# Altium schematic sheet Edge_Card_Interface.SchDoc
size A2; DocumentNumber: 9; SheetNumber: 9; SheetTotal: 10
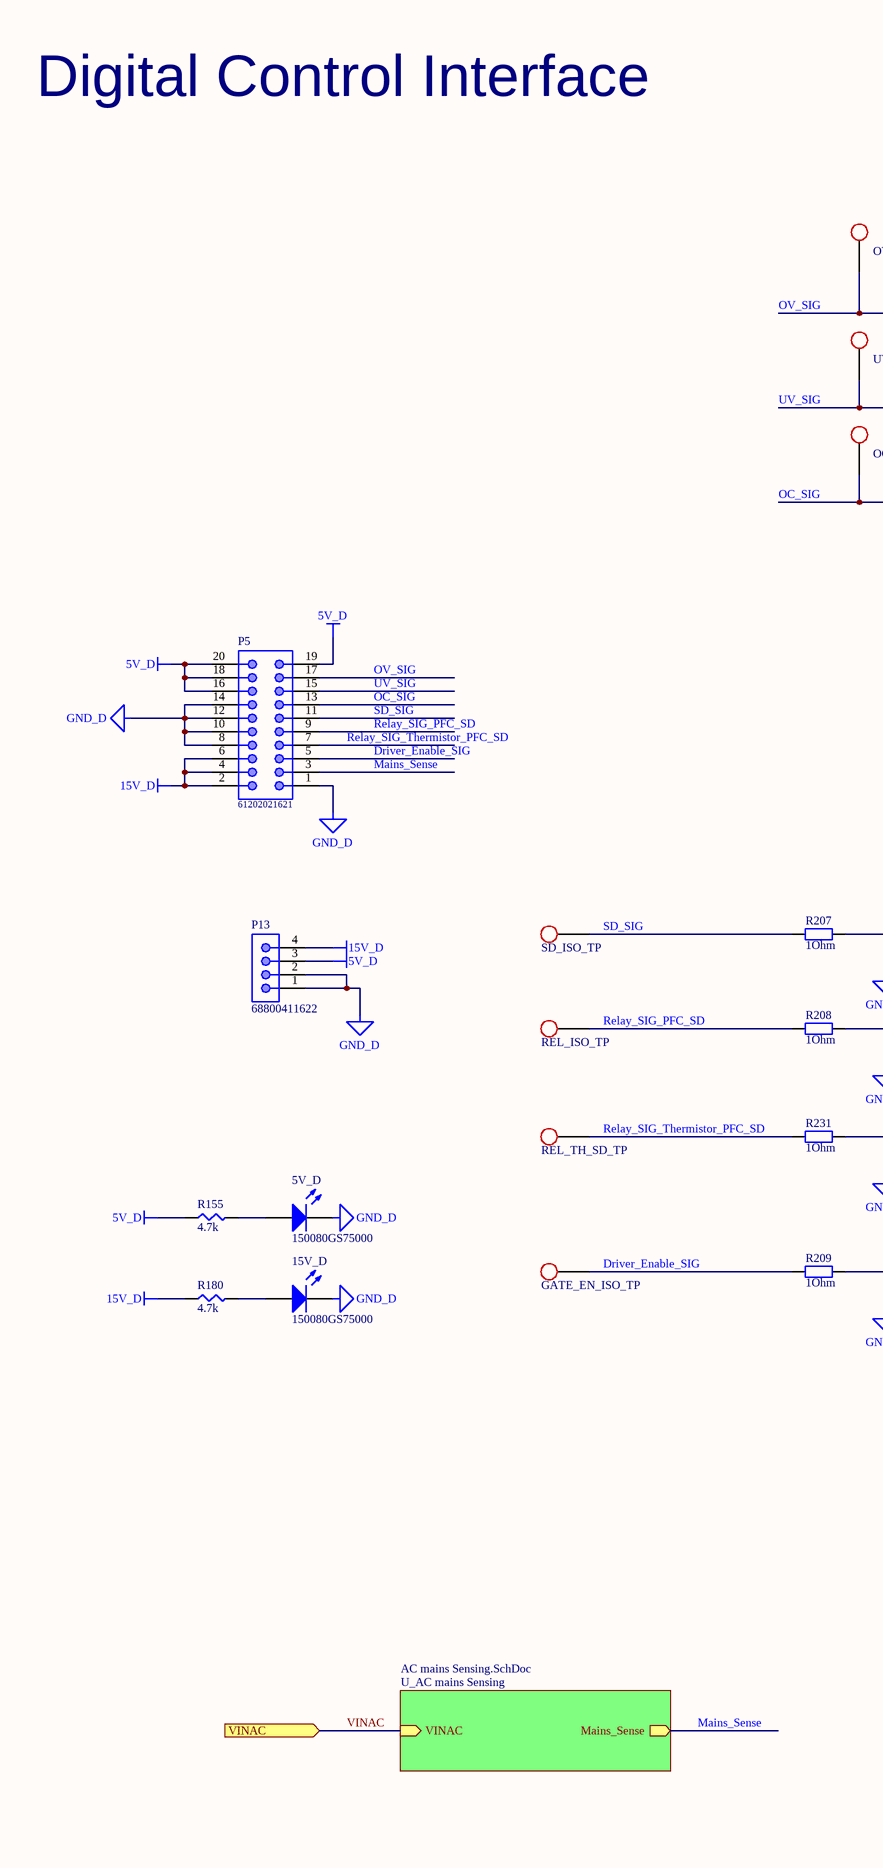
[diagram p0: Edge_Card_Interface.SchDoc, left]
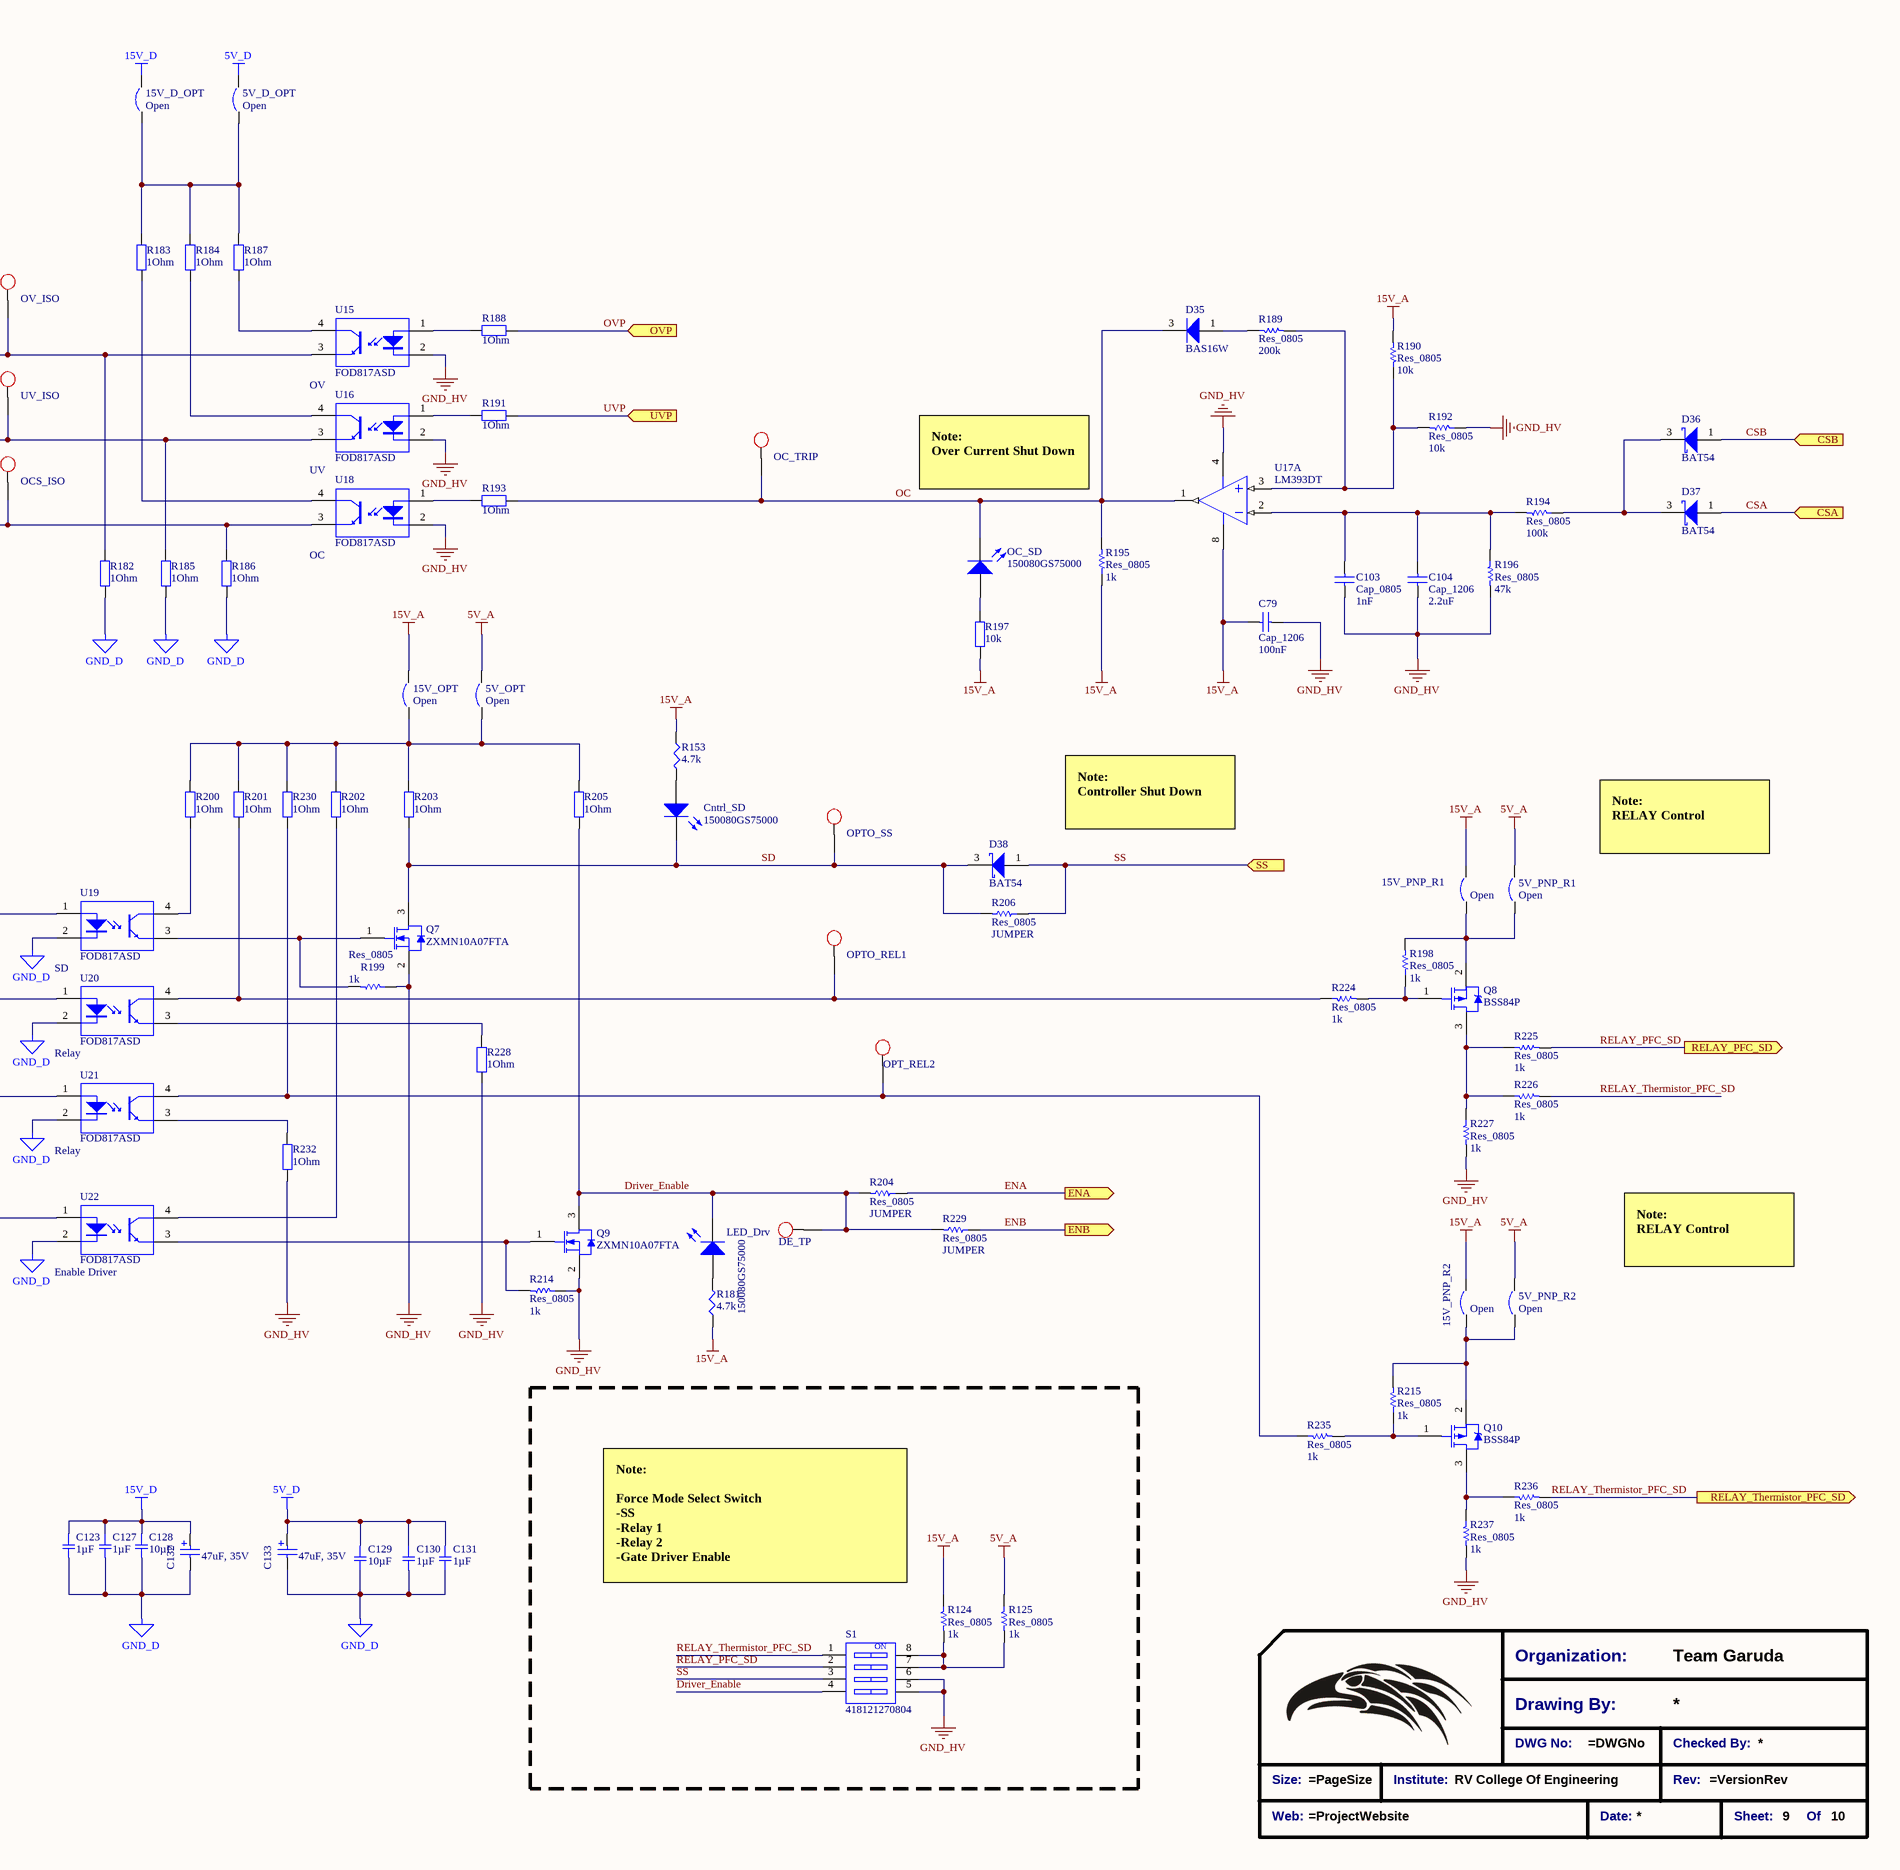
[diagram p1: Edge_Card_Interface.SchDoc, right]

## Parts
5V_D  150080GS75000  [0805_A]
5V_D_OPT  Open  [Solder Bridge - HP]  (no BOM)
5V_OPT  Open  [Solder Bridge - HP]  (no BOM)
5V_PNP_R1  Open  [Solder Bridge - HP - SQ]  (no BOM)
5V_PNP_R2  Open  [Solder Bridge - HP - SQ]  (no BOM)
15V_D  150080GS75000  [0805_A]
15V_D_OPT  Open  [Solder Bridge - HP]  (no BOM)
15V_OPT  Open  [Solder Bridge - HP]  (no BOM)
15V_PNP_R1  Open  [Solder Bridge - HP - SQ]  (no BOM)
15V_PNP_R2  Open  [Solder Bridge - HP - SQ]  (no BOM)
*?  Title_Block  (value not drawn)  (graphical)
C79  Cap_1206  value 100nF  [SMD-1206C]
C103  Cap_0805  Size: 1nF  [SMD-0805C]
C104  Cap_1206  value 2.2uF  [SMD-1206C]
C123  1µF  [SMD-0805C]
C127  1µF  [SMD-0805C]
C128  10µF  [SMD-1206C]
C129  10µF  [SMD-1206C]
C130  1µF  [SMD-0805C]
C131  1µF  [SMD-0805C]
C132  47uF, 35V  [WCAP-ASLU_6.3x7.7]
C133  47uF, 35V  [WCAP-ASLU_6.3x7.7]
Cntrl_SD  150080GS75000  [0805_A]
D35  BAS16W  [SOT95P278X110-3N]
D36  BAT54  [SOT95P278X110-3N]
D37  BAT54  [SOT95P278X110-3N]
D38  BAT54  [SOT95P278X110-3N]
DE_TP  Test Point  [Test_point_SMD]  (value not drawn)  (no BOM)
GATE_EN_ISO_TP  Test Point  [Test_point_SMD]  (value not drawn)  (no BOM)
LED_Drv  150080GS75000  [0805_A]
OC_SD  150080GS75000  [0805_A]
OC_TRIP  Test Point  [Test_point_SMD]  (value not drawn)  (no BOM)
OCS_ISO  Test Point  [Test_point_SMD]  (value not drawn)  (no BOM)
OPT_REL2  Test Point  [Test_point_SMD]  (value not drawn)  (no BOM)
OPTO_REL1  Test Point  [Test_point_SMD]  (value not drawn)  (no BOM)
OPTO_SS  Test Point  [Test_point_SMD]  (value not drawn)  (no BOM)
OV_ISO  Test Point  [Test_point_SMD]  (value not drawn)  (no BOM)
P5  61202021621  [61202021621]
P13  68800411622  [68800411622]
Q7  ZXMN10A07FTA  [DIOD-SOT23-3_D_V]
Q8  BSS84P  [SOT95P278X110-3N]
Q9  ZXMN10A07FTA  [DIOD-SOT23-3_D_V]
Q10  BSS84P  [SOT95P278X110-3N]
R124  Res_0805  value 1k  [WRIS-KSKE_0805_H=0.6mm]
R125  Res_0805  value 1k  [WRIS-KSKE_0805_H=0.6mm]
R153  4.7k  [SMD-0805-RES]
R155  4.7k  [SMD-0805-RES]
R180  4.7k  [SMD-0805-RES]
R181  4.7k  [SMD-0805-RES]
R182  1Ohm  [WRIS-KSKE_0805_H=0.6mm]
R183  1Ohm  [WRIS-KSKE_0805_H=0.6mm]
R184  1Ohm  [WRIS-KSKE_0805_H=0.6mm]
R185  1Ohm  [WRIS-KSKE_0805_H=0.6mm]
R186  1Ohm  [WRIS-KSKE_0805_H=0.6mm]
R187  1Ohm  [WRIS-KSKE_0805_H=0.6mm]
R188  1Ohm  [WRIS-KSKE_0805_H=0.6mm]
R189  Res_0805  value 200k  [WRIS-KSKE_0805_H=0.6mm]
R190  Res_0805  value 10k  [WRIS-KSKE_0805_H=0.6mm]
R191  1Ohm  [WRIS-KSKE_0805_H=0.6mm]
R192  Res_0805  value 10k  [WRIS-KSKE_0805_H=0.6mm]
R193  1Ohm  [WRIS-KSKE_0805_H=0.6mm]
R194  Res_0805  value 100k  [WRIS-KSKE_0805_H=0.6mm]
R195  Res_0805  value 1k  [WRIS-KSKE_0805_H=0.6mm]
R196  Res_0805  value 47k  [WRIS-KSKE_0805_H=0.6mm]
R197  10k  [WRIS-KSKE_0805_H=0.6mm]
R198  Res_0805  value 1k  [WRIS-KSKE_0805_H=0.6mm]
R199  Res_0805  value 1k  [WRIS-KSKE_0805_H=0.6mm]
R200  1Ohm  [WRIS-KSKE_0805_H=0.6mm]
R201  1Ohm  [WRIS-KSKE_0805_H=0.6mm]
R202  1Ohm  [WRIS-KSKE_0805_H=0.6mm]
R203  1Ohm  [WRIS-KSKE_0805_H=0.6mm]
R204  Res_0805  value JUMPER  [WRIS-KSKE_0805_H=0.6mm]
R205  1Ohm  [WRIS-KSKE_0805_H=0.6mm]
R206  Res_0805  value JUMPER  [WRIS-KSKE_0805_H=0.6mm]
R207  1Ohm  [WRIS-KSKE_0805_H=0.6mm]
R208  1Ohm  [WRIS-KSKE_0805_H=0.6mm]
R209  1Ohm  [WRIS-KSKE_0805_H=0.6mm]
R214  Res_0805  value 1k  [WRIS-KSKE_0805_H=0.6mm]
R215  Res_0805  value 1k  [WRIS-KSKE_0805_H=0.6mm]
R224  Res_0805  value 1k  [WRIS-KSKE_0805_H=0.6mm]
R225  Res_0805  value 1k  [WRIS-KSKE_0805_H=0.6mm]
R226  Res_0805  value 1k  [WRIS-KSKE_0805_H=0.6mm]
R227  Res_0805  value 1k  [WRIS-KSKE_0805_H=0.6mm]
R228  1Ohm  [WRIS-KSKE_0805_H=0.6mm]
R229  Res_0805  value JUMPER  [WRIS-KSKE_0805_H=0.6mm]
R230  1Ohm  [WRIS-KSKE_0805_H=0.6mm]
R231  1Ohm  [WRIS-KSKE_0805_H=0.6mm]
R232  1Ohm  [WRIS-KSKE_0805_H=0.6mm]
R235  Res_0805  value 1k  [WRIS-KSKE_0805_H=0.6mm]
R236  Res_0805  value 1k  [WRIS-KSKE_0805_H=0.6mm]
R237  Res_0805  value 1k  [WRIS-KSKE_0805_H=0.6mm]
REL_ISO_TP  Test Point  [Test_point_SMD]  (value not drawn)  (no BOM)
REL_TH_SD_TP  Test Point  [Test_point_SMD]  (value not drawn)  (no BOM)
S1  418121270804  [418121270804]
SD_ISO_TP  Test Point  [Test_point_SMD]  (value not drawn)  (no BOM)
U15  FOD817ASD  Signal: OV  [FAIR-MDIP-4_V]
U16  FOD817ASD  Signal: UV  [FAIR-MDIP-4_V]
U17  LM393DT  [SOIC127P570X175_HS-9N - No Thermal]  (part A of 2)
U18  FOD817ASD  Signal: OC  [FAIR-MDIP-4_V]
U19  FOD817ASD  Signal: SD  [FAIR-MDIP-4_V]
U20  FOD817ASD  Signal: Relay  [FAIR-MDIP-4_V]
U21  FOD817ASD  Signal: Relay  [FAIR-MDIP-4_V]
U22  FOD817ASD  Signal: Enable Driver  [FAIR-MDIP-4_V]
UV_ISO  Test Point  [Test_point_SMD]  (value not drawn)  (no BOM)

## Sub-sheets
U_AC mains Sensing = AC mains Sensing.SchDoc: VINAC (in), Mains_Sense (out)

## Ports
CSA (in), CSB (in), ENA (out), ENB (out), OVP (in), RELAY_PFC_SD (out), RELAY_Thermistor_PFC_SD (out), SS (in), UVP (in), VINAC (in)

## Nets
5V_A: 5V_OPT.2 5V_PNP_R1.2 5V_PNP_R2.2 R125.1
5V_D: 5V_D_OPT.2 C129.1 C130.1 C131.1 C133.2(P) P5.16 P5.18 P5.19 P5.20 P13.3 R155.1
15V_A: 15V_OPT.2 15V_PNP_R1.2 15V_PNP_R2.2 C79.1 R124.1 R153.1 R181.1 R190.2 R195.1 R197.1 U17.8(VCC+)
15V_D: 15V_D_OPT.2 C123.1 C127.1 C128.1 C132.2(P) P5.2 P5.4 P5.6 P13.4 R180.1
GND_D: 5V_D.1(K) 15V_D.1(K) C123.2 C127.2 C128.2 C129.2 C130.2 C131.2 C132.1(N) C133.1(N) P5.1 P5.8 P5.10 P5.12 P5.14 P13.1 P13.2 R182.1 R185.1 R186.2 U19.2(CATHODE) U20.2(CATHODE) U21.2(CATHODE) U22.2(CATHODE)
GND_HV: C79.2 C103.1 C104.2 Q7.2(S) Q9.2(S) R192.1 R196.2 R199.1 R214.1 R227.2 R228.1 R232.1 R237.2 S1.5 S1.6 U15.2(CATHODE) U16.2(CATHODE) U17.4(VCC-) U18.2(CATHODE)
CSA: D37.1(A) ; port CSA
CSB: D36.1(A) ; port CSB
Driver_Enable: DE_TP.1 LED_Drv.1(K) Q9.3(D) R204.2 R205.1 R229.2 S1.4
Driver_Enable_SIG: GATE_EN_ISO_TP.1 P5.5 R209.2
ENA: R204.1 ; port ENA
ENB: R229.1 ; port ENB
Mains_Sense: P5.3 ; sheet U_AC mains Sensing/Mains_Sense
OC: D35.3(K) OC_SD.1(K) OC_TRIP.1 R193.1 R195.2 U17.1(OUT1)
OC_SIG: OCS_ISO.1 P5.13 R186.1 U18.3(EMITTER)
OV_SIG: OV_ISO.1 P5.17 R182.2 U15.3(EMITTER)
OVP: R188.1 ; port OVP
RELAY_PFC_SD: R225.2 S1.2 ; port RELAY_PFC_SD
Relay_SIG_PFC_SD: P5.9 R208.2 REL_ISO_TP.1
Relay_SIG_Thermistor_PFC_SD: P5.7 R231.2 REL_TH_SD_TP.1
RELAY_Thermistor_PFC_SD: R226.2 R236.2 S1.1 ; port RELAY_Thermistor_PFC_SD
SD: Cntrl_SD.1(K) D38.3(K) OPTO_SS.1 Q7.3(D) R203.1 R206.2
SD_SIG: P5.11 R207.2 SD_ISO_TP.1
SS: D38.1(A) R206.1 S1.3 ; port SS
UV_SIG: P5.15 R185.2 U16.3(EMITTER) UV_ISO.1
UVP: R191.1 ; port UVP
VINAC: port VINAC, sheet U_AC mains Sensing/VINAC
Net5V_D_2: 5V_D.2(A) R155.2
Net5V_D_OPT_1: 5V_D_OPT.1 15V_D_OPT.1 R183.2 R184.2 R187.1
Net5V_OPT_1: 5V_OPT.1 15V_OPT.1 R200.2 R201.2 R202.2 R203.2 R205.2 R230.2
Net5V_PNP_R1_1: 5V_PNP_R1.1 15V_PNP_R1.1 Q8.2(SOURCE) R198.2
Net5V_PNP_R2_1: 5V_PNP_R2.1 15V_PNP_R2.1 Q10.2(SOURCE) R215.2
Net15V_D_2: 15V_D.2(A) R180.2
NetC103_2: C103.2 C104.1 R194.2 R196.1 U17.2(IN1-)
NetCntrl_SD_2: Cntrl_SD.2(A) R153.2
NetD35_1: D35.1(A) R189.1
NetD36_3: D36.3(K) D37.3(K) R194.1
NetLED_Drv_2: LED_Drv.2(A) R181.2
NetOC_SD_2: OC_SD.2(A) R197.2
NetOPT_REL2_1: OPT_REL2.1 R230.1 R235.1 U21.4(COLLECTOR)
NetOPTO_REL1_1: OPTO_REL1.1 R201.1 R224.1 U20.4(COLLECTOR)
NetQ7_1: Q7.1(G) R199.2 U19.3(EMITTER)
NetQ8_1: Q8.1(GATE) R198.1 R224.2
NetQ8_3: Q8.3(DRAIN) R225.1 R226.1 R227.1
NetQ9_1: Q9.1(G) R214.2 U22.3(EMITTER)
NetQ10_1: Q10.1(GATE) R215.1 R235.2
NetQ10_3: Q10.3(DRAIN) R236.1 R237.1
NetR124_2: R124.2 R125.2 S1.7 S1.8
NetR183_1: R183.1 U18.4(COLLECTOR)
NetR184_1: R184.1 U16.4(COLLECTOR)
NetR187_2: R187.2 U15.4(COLLECTOR)
NetR188_2: R188.2 U15.1(ANODE)
NetR189_2: R189.2 R190.1 R192.2 U17.3(IN1+)
NetR191_2: R191.2 U16.1(ANODE)
NetR193_2: R193.2 U18.1(ANODE)
NetR200_1: R200.1 U19.4(COLLECTOR)
NetR202_1: R202.1 U22.4(COLLECTOR)
NetR207_1: R207.1 U19.1(ANODE)
NetR208_1: R208.1 U20.1(ANODE)
NetR209_1: R209.1 U22.1(ANODE)
NetR228_2: R228.2 U20.3(EMITTER)
NetR231_1: R231.1 U21.1(ANODE)
NetR232_2: R232.2 U21.3(EMITTER)

## Notes on the sheet
- Digital Control Interface
- Note:                                                                                  Over Current Shut Down
- Note:                                                                                Controller Shut Down
- Note:                                                                                 RELAY Control
- (near R124) Note:
  Force Mode Select Switch
  -SS
  -Relay 1
  -Relay 2
  -Gate Driver Enable
- (in symbol 418121270804) ON
- (in symbol Title_Block) Organization:; Team Garuda; Drawing By:; DWG No:; Checked By:; Size:; Institute:; RV College Of Engineering; Rev:; Web:; Date:; Sheet:; Of

## Library data of the parts
5V_D 15V_D Cntrl_SD LED_Drv OC_SD = 150080GS75000: SMD mono-color Chip LED, WL-SMCW, Green; PackageReference: 0805_A; Color: Green; PartNumber: 150080GS75000; ComponentLink1Description: Manufacturer URL; ComponentLink1URL: http://www.we-online.com; ComponentLink2Description: Datasheet; ComponentLink2URL: http://katalog.we-online.com/led/datasheet/150080GS75000.pdf
5V_D_OPT 5V_OPT 5V_PNP_R1 5V_PNP_R2 15V_D_OPT 15V_OPT 15V_PNP_R1 15V_PNP_R2 = Solder Bridge: Circuit Breaker; Published: 24-Mar-1999; Revision: July-2002: Re-released for DXP Platform.; Publisher: Altium Limited
*? = Title_Block: Standard Title Block
C79 C104 = Cap: Capacitor; Published: 8-Jun-2000; LatestRevisionDate: 17-Jul-2002; LatestRevisionNote: Re-released for DXP Platform.; PackageReference: RAD-0.3; Publisher: Altium Limited; PackageDescription: Radial Cap, Thru-Hole; 2 Leads; 0.3 in Pin Spacing
C103 = Cap: Capacitor; Value: 100pF; Published: 8-Jun-2000; LatestRevisionDate: 17-Jul-2002; LatestRevisionNote: Re-released for DXP Platform.; PackageReference: RAD-0.3; Publisher: Altium Limited; PackageDescription: Radial Cap, Thru-Hole; 2 Leads; 0.3 in Pin Spacing
C123 C127 C130 C131 = GRM219R61H105KA73D: CAP CER 1UF 50V X5R 0805; Manufacturer: Murata Electronics North America; Factory Stock: 0; Unit Price (USD): 0.19; Minimum Quantity: 1; Tolerance: ±10%; Datasheets: http://www.murata.com/~/media/webrenewal/support/library/catalog/products/capacitor/mlcc/c02e.pdf; Image: //media.digikey.com/Renders/Murata%20Renders/0805%20(2012%20Metric)%20.85mm.jpg; Digi-Key Part Number: 490-10743-1-ND; Part Number: GRM219R61H105KA73D; Quantity Available: 3572; @ qty: 0; Packaging: Cut Tape (CT); Series: GRM; Part Status: Active; Value: 1µF; Voltage: 50V; Temperature Coefficient: X5R; Operating Temperature: -55°C ~ 85°C; Features: -; Ratings: -; Applications: General Purpose; Mounting Type: Surface Mount, MLCC; Package / Case: 0805 (2012 Metric); Size / Dimension: 0.079" L x 0.049" W (2.00mm x 1.25mm); Height - Seated (Max): -; Thickness (Max): 0.037" (0.95mm); Lead Spacing: -; Lead Style: -
C128 C129 = GCJ31CR71A106KA13L: CAP CER 10UF 10V X7R 1206; Manufacturer: Murata Electronics North America; Factory Stock: 0; Unit Price (USD): 0.71; Minimum Quantity: 1; Tolerance: ±10%; Datasheets: http://www.murata.com/~/media/webrenewal/support/library/catalog/products/capacitor/mlcc/c03e.ashx; Image: //media.digikey.com/Renders/Murata%20Renders/GR331BD72E473KW01L.jpg; Digi-Key Part Number: 490-5848-1-ND; Part Number: GCJ31CR71A106KA13L; Quantity Available: 33084; @ qty: 0; Packaging: Cut Tape (CT); Series: GCJ; Part Status: Active; Value: 10µF; Voltage: 10V; Temperature Coefficient: X7R; Operating Temperature: -55°C ~ 125°C; Features: Soft Termination; Ratings: AEC-Q200; Applications: Automotive, Boardflex Sensitive; Mounting Type: Surface Mount, MLCC; Package / Case: 1206 (3216 Metric); Size / Dimension: 0.126" L x 0.063" W (3.20mm x 1.60mm); Height - Seated (Max): -; Thickness (Max): 0.063" (1.60mm); Lead Spacing: -; Lead Style: -
C132 C133 = 865090545008: WCAP-ASLU Aluminium Electrolytic Capacitors, D6.3mm x L7.7mm, 47uF, +/-20%, 35VDC; Dissipation Factor: 14%; Leakage Current: 3.29uA; Endurance: 1000h; Technical Reference: ASBD077470M035DVCTCA000; Ripple Current max.: 75mA; ComponentLink1Description: Manufacturer; ComponentLink1URL: http://www.we-online.de; ComponentLink2Description: Datasheet; ComponentLink2URL: https://katalog.we-online.com/pbs/datasheet/865090545008.pdf; Mounting Technology: SMD; Operating Temperature: -40 to +85degC; Packaging: Tape and Reel; Part Number: 865090545008; Publisher: Wurth Elektronik; Capacitance: 47uF; Diameter: 6.3mm; Length: 7.7mm; Published Date: August 2019; Rated Voltage: 35VDC; Capacitance Tolerance: +/-20%
D35 = BAS16: Silicon Switching Diode, SOT323, Reel, Green; Manufacturer: Infineon; IR (max): 100Â nA; Configuration: Single; VBR (min): 85Â V; VR (max): 80Â V; trr (max): 4Â ns; Green: TRUE; VF (max): 1.25Â V; IF (max): 250Â mA; Mounting Technology: Surface Mount; PackageReference: SOT323; ComponentLink2URL: http://www.infineon.com/dgdl/bas16series.pdf?folderId=db3a30431400ef6801141b5844e103ea&fileId=db3a30431400ef6801141b93811b03ff; Halogen-free: TRUE; ComponentLink2Description: Datasheet; PartNumber: BAS16W; ComponentLink1Description: Manufacturer URL; ComponentLink3URL: http://www.infineon.com/dgdl/SOT323-Package_Overview.pdf?folderId=db3a30431936bc4b0119533e1dcb3c92&fileId=db3a30431936bc4b011953495f283cb1; ComponentLink1URL: http://www.infineon.com/; PackageDescription: 3-Pin Small Outline Transistor Package, 1.25 x 2 mm Body, 0.65 mm Pitch; ComponentLink3Description: Package Specification
D36-D38 = BAT54: Silicon Switching Diode, SOT323, Reel, Green; PartNumber: BAS16W; Manufacturer: Infineon; IR (max): 100Â nA; Configuration: Single; VBR (min): 85Â V; VR (max): 80Â V; trr (max): 4Â ns; Green: TRUE; VF (max): 1.25Â V; IF (max): 250Â mA; Mounting Technology: Surface Mount; PackageReference: SOT323; ComponentLink2URL: http://www.infineon.com/dgdl/bas16series.pdf?folderId=db3a30431400ef6801141b5844e103ea&fileId=db3a30431400ef6801141b93811b03ff; Halogen-free: TRUE; ComponentLink2Description: Datasheet; ComponentLink1Description: Manufacturer URL; ComponentLink3URL: http://www.infineon.com/dgdl/SOT323-Package_Overview.pdf?folderId=db3a30431936bc4b0119533e1dcb3c92&fileId=db3a30431936bc4b011953495f283cb1; ComponentLink1URL: http://www.infineon.com/; PackageDescription: 3-Pin Small Outline Transistor Package, 1.25 x 2 mm Body, 0.65 mm Pitch; ComponentLink3Description: Package Specification
DE_TP GATE_EN_ISO_TP OC_TRIP OCS_ISO OPT_REL2 OPTO_REL1 OPTO_SS OV_ISO REL_ISO_TP REL_TH_SD_TP SD_ISO_TP UV_ISO = Test Point: TP
P5 = 61202021621: Male Box Header WR-BHD, THT, Vertical, pitch 2.54 mm, 20 pins; Pitch: 2.54 mm; Working Voltage: 250 VAC; Withstanding Voltage: 500 VAC; Contact Resistance: 20 mOhm; Pin Number: 20; ComponentLink1Description: Manufacturer; ComponentLink1URL: http://www.we-online.de; ComponentLink2Description: Datasheet; ComponentLink2URL: https://katalog.we-online.de/em/datasheet/6120xx21621.pdf; Part Number: 61202021621; Published Date: August 2018; Publisher: Wurth Elektronik; Operating Temperature: -40 to 125 degC; Packaging: Tray; Gender: Male; Mounting Technology: THT; Orientation: Vertical
P13 = 68800411622: WR-WTB “J” Type THT Vertical Male Shrouded Header, pitch 2.5mm, 4p; Pin Number: 4; Contact Resistance: 20mOhm; Rated Current: 3A; Withstanding Voltage: 800VAC; Working Voltage: 250VAC; ComponentLink1Description: Manufacturer; ComponentLink1URL: http://www.we-online.de; ComponentLink2Description: Datasheet; ComponentLink2URL: https://www.we-online.com/catalog/datasheet/68800411622.pdf; Pitch: 2.5mm; Published Date: January 2020; Publisher: Wurth Elektronik; Mounting Technology: THT; Packaging: Bag; Operating Temperature: -25 to +85degC; Part Number: 68800411622; Gender: Male; Type: Vertical
Q7 Q9 = CMP-2000-07433-1: N-Channel Enhancement Mode MOSFET, 100 V, -55 to 150 degC, 3-Pin SOT23, RoHS, Tape and Reel; Manufacturer: Diodes Inc; Drain-to-Source Voltage [Vdss]: 100V; Qg Gate Charge: 2.9nC; Rated Power Dissipation: 625mW; Drain-Source On Resistance-Max: 0.7O; Package Description: 3-Pin Small Outline Transistor, Body 2.9 x 1.3 mm, Pitch 0.96 mm; Channel Type: N-Channel; Mounting Technology: SurfaceMount; Datasheet Version: Rev. 6-2, 08/2012; Manufacturer URL: http://www.diodes.com/; Datasheet URL: http://www.diodes.com/_files/datasheets/ZXMN10A07F.pdf; Package Reference: SOT23-3
Q8 Q10 = CMP-1099-00028-1: P-Channel SIPMOS Small-Signal-Transistor, -60 V VDS, -0.17 A ID, -55 to 150 degC, PG-SOT23, Reel, Green; Manufacturer: Infineon; VGS(th) (max): -2Â V; VGS(th) (min): -1Â V; VDS (max): -60Â V; Rth: 350Â K/W; Pto t (max): 0.36Â W; ID (max): -0.17Â A; IDpuls (max): -0.68Â A; RDS (on) (max) (@4.5V): 12,000Â mOhm; QG: 1Â nC; Green: TRUE; RDS (on) (max): 8,000Â mOhm; ComponentLink3URL: http://www.infineon.com/dgdl/SOT23-Package_Overview.pdf?folderId=db3a30431936bc4b0119532290053c66&fileId=db3a30431936bc4b0119533468123c85; ComponentLink3Description: Package Specification; Packing: Reel; PartNumber: BSS84P; ComponentLink2Description: Datasheet; Mounting Technology: Surface Mount; ComponentLink2URL: http://www.infineon.com/dgdl/BSS84P_Rev2.7%5B1%5D.pdf?folderId=db3a304314dca38901154a72e3951a65&fileId=db3a304330f68606013118ac7a9b4549; PackageReference: PG-SOT23; ComponentLink1URL: http://www.infineon.com/; PackageVersion: Apr-08; ComponentLink1Description: Manufacturer URL; PackageDescription: 3-Pin Small Outline Transistor Package, 2.9 x 1.3 mm Body, 0.95 mm Pitch; Halogen-free: TRUE; DatasheetVersion: Rev. 2.7
R124 R125 R189 R190 R192 R194-R196 R198 R199 R204 R206 R214 R215 R224-R227 R229 R235-R237 = Res1: Resistor; Published: 8-Jun-2000; LatestRevisionDate: 17-Jul-2002; LatestRevisionNote: Re-released for DXP Platform.; PackageReference: AXIAL-0.3; Publisher: Altium Limited; PackageDescription: Axial Device, Thru-Hole; 2 Leads; 0.3 in Pin Spacing
R153 R155 R180 R181 = ERJ-6ENF4701V: RES SMD 4.7K OHM 1% 1/8W 0805; Manufacturer: Panasonic Electronic Components; Factory Stock: 0; Unit Price (USD): 0.00729; @ qty: 1500; Minimum Quantity: 1; Power (Watts): 0.125W, 1/8W; Temperature Coefficient: ±100ppm/°C; Part Number: ERJ-6ENF4701V; Datasheets: http://industrial.panasonic.com/www-cgi/jvcr13pz.cgi?E+PZ+3+AOA0002+ERJ6ENF4701V+7+WW; Image: //media.digikey.com/Renders/Panasonic%20Renders/ERJ-0805%20Pkg.jpg; Digi-Key Part Number: P4.70KCCT-ND; Quantity Available: 312387; Packaging: Cut Tape (CT); Series: ERJ; Part Status: Active; Value: 4.7k; Tolerance: ±1%; Composition: Thick Film; Features: Automotive AEC-Q200; Operating Temperature: -55°C ~ 155°C; Package / Case: 0805 (2012 Metric); Supplier Device Package: 0805; Size / Dimension: 0.079" L x 0.049" W (2.00mm x 1.25mm); Height - Seated (Max): 0.028" (0.70mm); Number of Terminations: 2; Failure Rate: -
R182-R188 R191 R193 R200-R203 R205 R207-R209 R228 R230-R232 = 560050320011: WRIS-KSKE Thick Film Resistors, size 0805, 1Ohm, +/-1%, 0.33W; Rated Current: 0.57A; Temperature Coefficient of Resistance: +/-100ppm/degC; Technical Reference: KE08051R00F103KAATP0000; ComponentLink1Description: Manufacturer; ComponentLink1URL: http://www.we-online.de; ComponentLink2Description: Datasheet; ComponentLink2URL: https://katalog.we-online.com/pbs/datasheet/560050320011.pdf; Publisher: Wurth Elektronik; Rated Power: 0.33W; Resistance: 1Ohm; Mounting Technology: SMT; Height: 0.6mm; Part Number: 560050320011; Packaging: Tape and Reel; Published Date: September 2019; Size: 0805; Length: 2mm; Operating Temperature: -55 to +155degC; Resistance Tolerance: +/-1%; Width: 1.25mm
R197 = 560050320001: WRIS-KSKE Thick Film Resistors, size 0805, 0.1Ohm, +/-1%, 0.33W; Rated Current: 1.81A; Temperature Coefficient of Resistance: 250ppm/degC; Technical Reference: KE0805R100F103LAATP0000; ComponentLink1Description: Manufacturer; ComponentLink1URL: http://www.we-online.de; ComponentLink2Description: Datasheet; ComponentLink2URL: https://katalog.we-online.com/pbs/datasheet/560050320001.pdf; Publisher: Wurth Elektronik; Rated Power: 0.33W; Resistance: 0.1Ohm; Mounting Technology: SMT; Height: 0.6mm; Part Number: 560050320001; Packaging: Tape and Reel; Published Date: September 2019; Size: 0805; Length: 2mm; Operating Temperature: -55 to +155degC; Resistance Tolerance: +/-1%; Width: 1.25mm
S1 = 418121270804: WS-DISV Small Compact SMT Dip Switch, Raised Actuator, pitch 2.54mm, 4p; Operation Force: 600g; Pole Number: 4; Actuator Type: Raise Type; Circuit: SPST-NO; Rated Current Switching: 25mA; Rated Current Non-Switching: 100mA; Rated Voltage Non-Switching: 50VDC; Rated Voltage Switching: 24VDC; ComponentLink1Description: Manufacturer; ComponentLink1URL: http://www.we-online.de; ComponentLink2Description: Datasheet; ComponentLink2URL: https://katalog.we-online.com/em/datasheet/418121270804.pdf; Pitch: 2.54mm; Contact Material: Copper Alloy; Mounting Technology: SMT; Operating Temperature: -40 to +85degC; Contact Plating: Gold; Packaging: Tape and Reel; Part Number: 418121270804; Publisher: Wurth Elektronik; Published Date: September 2019
U15 U16 U18-U22 = CMP-2000-06279-1: Phototransistor Optocoupler, 4 us Rise, 3 us Fall, 5000 Vrms, -55 to 110 degC, 4-Pin MDIP, RoHS, Tape and Reel; Manufacturer: Fairchild Semiconductor; Maximum Input Current: 50mA; Maximum Forward Voltage: 1.4V; Maximum Reverse Voltage: 6V; Product Width: 7mm(Max); Input Type: DC; Maximum Current Transfer Ratio: 160%; Maximum Rise Time: 18us; Typical Rise Time: 4us; Typical Forward Voltage: 1.2V; Product Length: 5.1mm(Max); Package Version: 10/2014; Maximum Collector Emitter Saturation Voltage: 200mV; Number of Channels per Chip: 1; Product Height: 4mm(Max); Maximum Power Dissipation: 200mW; Typical Fall Time: 3us; Maximum Collector Emitter Voltage: 70V; Pin_Count: 4; Minimum Current Transfer Ratio: 80%; Output Device: Transistor; Manufacturer URL: https://www.fairchildsemi.com/; Family: FOD817; Supplier_Package: PDIPSMDBlack; Datasheet URL: https://www.fairchildsemi.com/datasheets/FO/FOD817.pdf; Package Description: 4-Pin Surface Mount Device, Body 6.5 x 4.6 mm, Pitch 2.54 mm; Mounting Technology: SurfaceMount; Package Reference: MDIP 4L; Maximum Operating Temperature: 110C; Mounting: SurfaceMount; Maximum Fall Time: 18us; Package URL: https://www.fairchildsemi.com/package-drawings/N0/N04C.pdf; Product Type: TransistorandPhotovoltaicOutputPhotoCouplers; Datasheet Version: Rev. 2.8, 11/2015; Minimum Operating Temperature: -55C; Maximum Collector Current: 50mA; Packaging: TapeandReel; Minimum Isolation Voltage: 5000Vrms; Output Type: DC
U17 = CMP-2000-06550-1: Low-Power, Dual-Voltage Comparator, 2 to 36 V, 0 to 70 degC, 8-Pin SOIC (SO), RoHS, Tape and Reel; Manufacturer: STMicroelectronics; Voltage - Supply, Single/Dual (±): 2V~36V,±1V~18V; Current - Input Bias (Max): 0.25µA@5V; Number of Elements: 2; Current - Output (Typ): 18mA@5V; Other Names: 497-1593-2; Voltage - Input Offset (Max): 5mV@30V; Output Type: CMOS,DTL,ECL,MOS,Open-Collector,TTL; EDA / CAD Models: DownloadfromAcceleratedDesigns; Other Related Documents: LM393ViewAllSpecificationsLM393ViewAllSpecifications; Online Catalog: Comparators-2elements; Current - Quiescent (Max): 2.5mA; Standard Package: 2,500; Manufacturer URL: http://www.st.com/; Package Description: 8-Pin Small Outline Integrated Circuit, Body 4.9 x 3.9 mm, Pitch 1.27 mm; Packaging: Tape&Reel(TR); Datasheet Version: Rev. 15, 02/2016; Category: IntegratedCircuits(ICs); Operating Temperature: 0°C~70°C; Mounting Type: SurfaceMount; Supplier Device Package: 8-SO; Datasheet URL: http://www.st.com/content/ccc/resource/technical/document/datasheet/group1/b4/cc/cf/13/18/28/44/f5/CD00000465/files/CD00000465.pdf/jcr:content/translations/en.CD00000465.pdf; Family: Linear-Comparators; Mounting Technology: SurfaceMount; Type: GeneralPurpose; Package Reference: SO-8; Package / Case: 8-SOIC(0.154",3.90mmWidth)